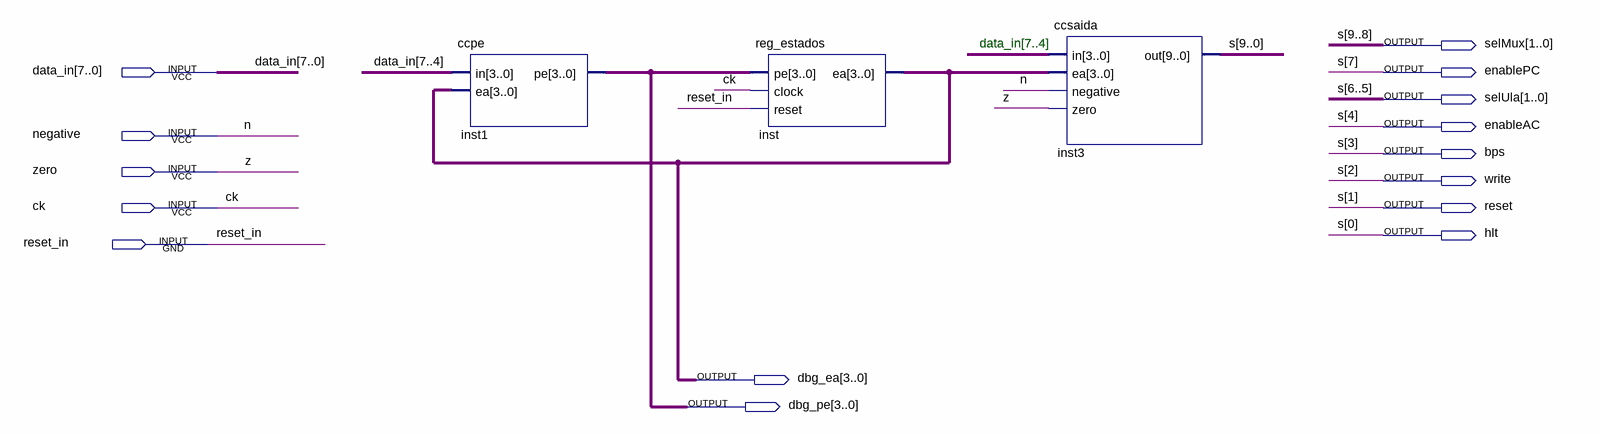
[diagram p0: schematic sheet]
// Quartus schematic uc.bdf as structural Verilog: 3 symbols, 15 pins
module uc (
  input  [7:0] data_in,
  input  negative,
  input  zero,
  input  ck,
  input  reset_in,
  output [1:0] selMux,
  output enablePC,
  output [1:0] selUla,
  output enableAC,
  output bps,
  output write,
  output reset,
  output hlt,
  output [3:0] dbg_ea,
  output [3:0] dbg_pe
);

  ccpe inst1 (.in(data_in[7:4]), .ea(dbg_ea), .pe(dbg_pe));
  reg_estados inst (.pe(dbg_pe), .clock(ck), .reset(reset_in), .ea(dbg_ea));
  ccsaida inst3 (
    .in(data_in[7:4]), .ea(dbg_ea), .negative(negative), .zero(zero),
    .out({selMux, enablePC, selUla, enableAC, bps, write, reset, hlt}));

  // Other names for the same wires on the sheet: n = negative;
  //   s[9:0] = {selMux, enablePC, selUla, enableAC, bps, write, reset, hlt}; z = zero

  // Notes on the sheet:
  //   data_in[7..4]
endmodule
